# EAGLE design DOORLOCK_v3 (EAGLE 7.5.0)

## Sheet 1 of 2
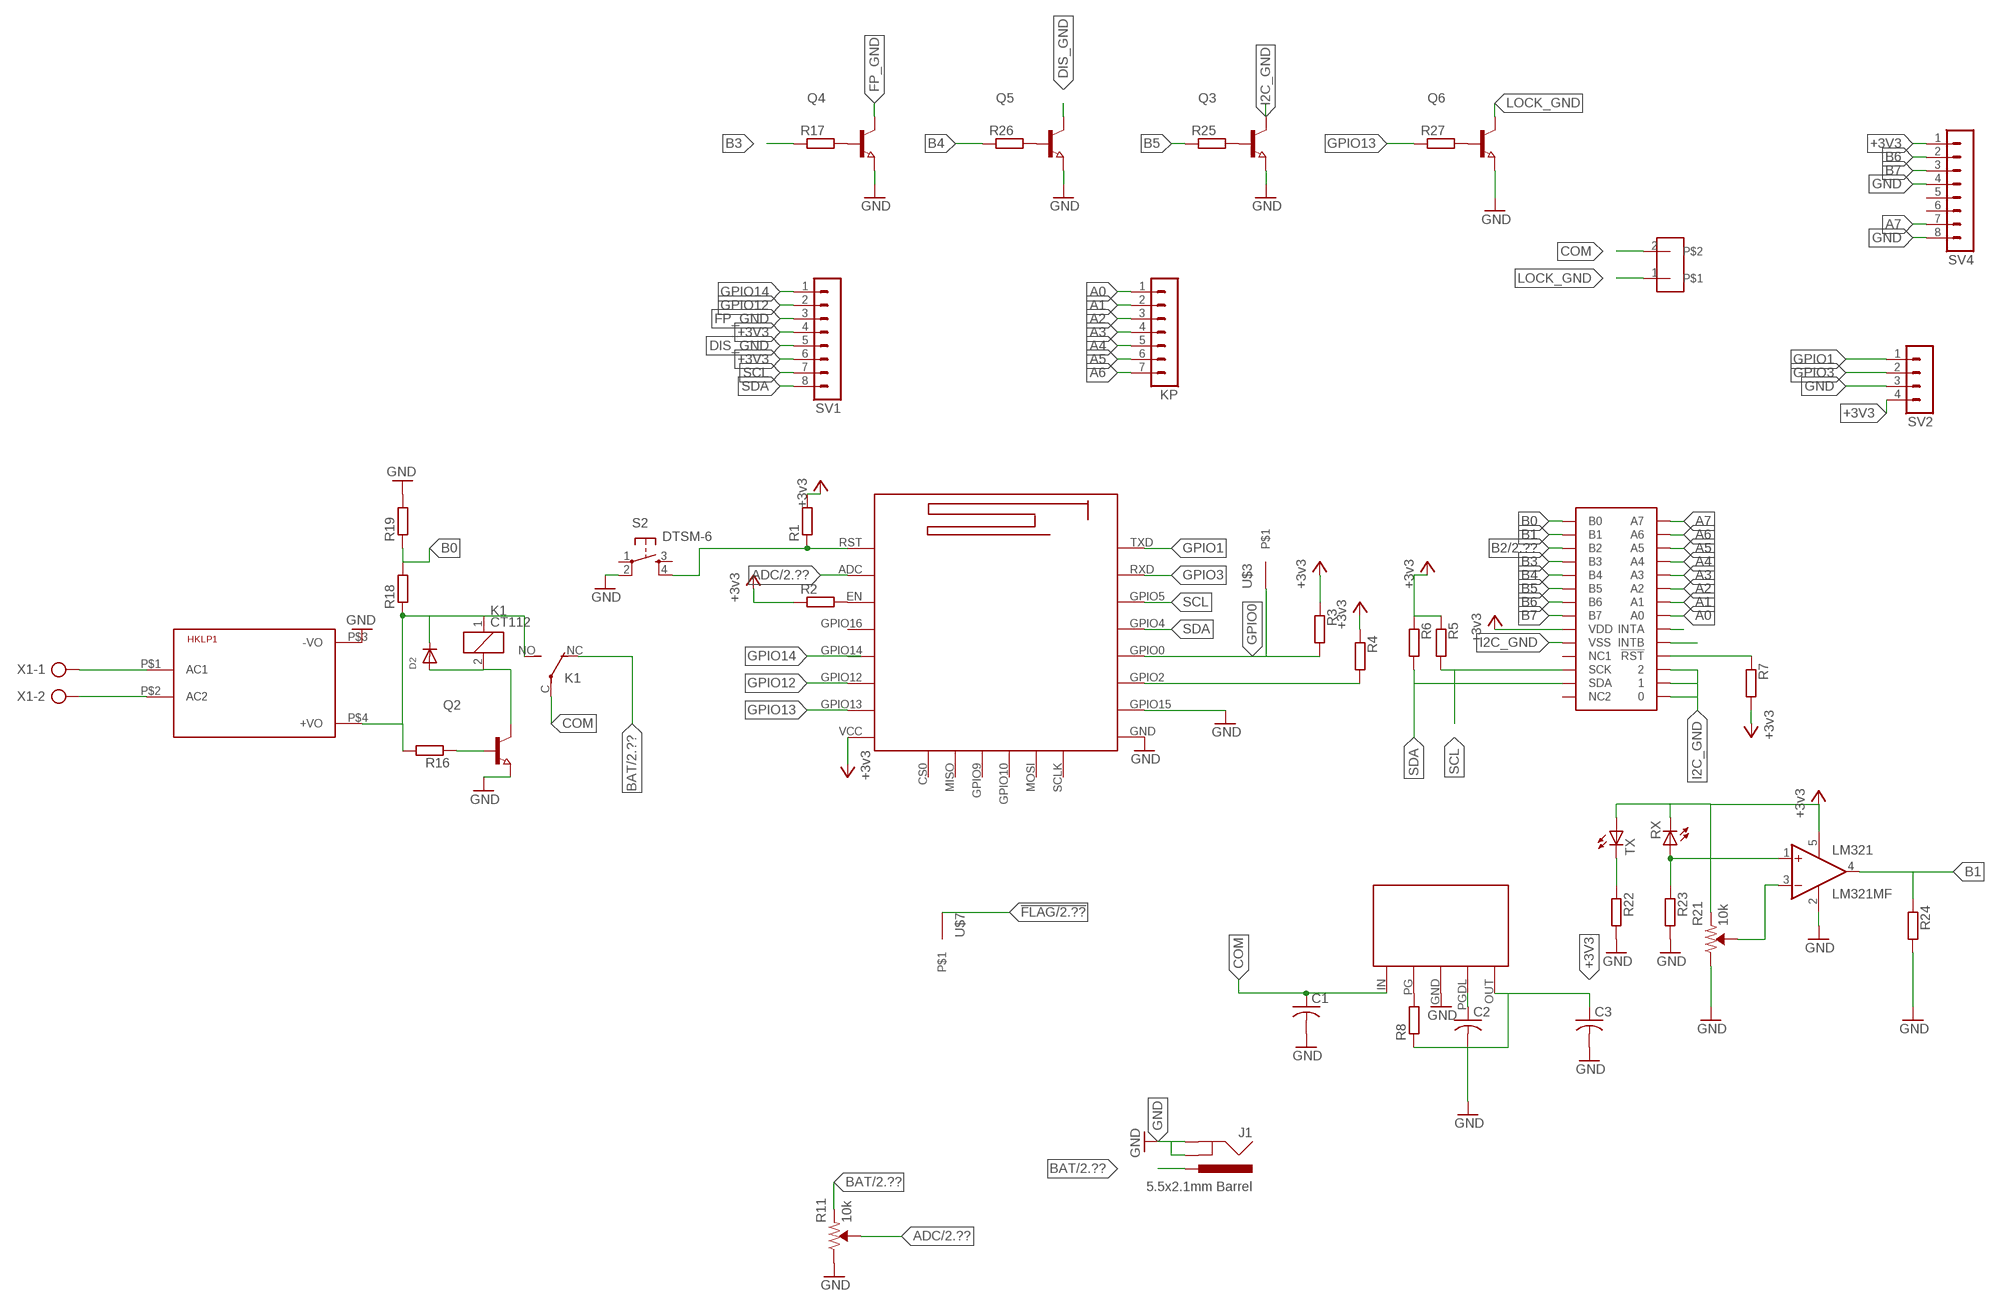
[diagram p0: schematic, sheet 1]

### Parts
C1  C-USC1206  [C1206]
C2  C-USC1206  [C1206]
C3  C-USC1206  [C1206]
D2  DIODESOD-123  [SOD-123]
HKLP1  HKLPM01  [HKLPM01]
J1  5.5x2.1mm Barrel  POWER_JACKSMD  [POWER_JACK_SMD]
K1  CT112  [CT-SLIM]
KP  MA07-1  [MA07-1]
LM321  LM321MF  [SOT23-5]
MCP23017  MCF23017  [MAX23017]
MP2014  MP2014  [MP2014]
Q2  NPN-TRANSISTOR_SOT89  [SOT89]
Q3  NPN-TRANSISTOR_SOT89  [SOT89]
Q4  NPN-TRANSISTOR_SOT89  [SOT89]
Q5  NPN-TRANSISTOR_SOT89  [SOT89]
Q6  NPN-TRANSISTOR_SOT89  [SOT89]
R1  R-EU_0204/2V  [0204V]
R2  R-EU_0204/2V  [0204V]
R3  R-EU_0204/2V  [0204V]
R4  R-EU_0204/2V  [0204V]
R5  R-EU_0204/2V  [0204V]
R6  R-EU_0204/2V  [0204V]
R7  R-EU_0204/2V  [0204V]
R8  R-EU_0204/2V  [0204V]
R11  10k  TRIMPOT-SMD-3MM-OPEN-1/10W-25%  [TRIMPOT-SMD-TC33X]
R16  R-EU_0204/2V  [0204V]
R17  R-EU_0204/2V  [0204V]
R18  R-EU_0204/2V  [0204V]
R19  R-EU_0204/2V  [0204V]
R21  10k  TRIMPOT-SMD-3MM-OPEN-1/10W-25%  [TRIMPOT-SMD-TC33X]
R22  R-EU_0204/2V  [0204V]
R23  R-EU_0204/2V  [0204V]
R24  R-EU_0204/2V  [0204V]
R25  R-EU_0204/2V  [0204V]
R26  R-EU_0204/2V  [0204V]
R27  R-EU_0204/2V  [0204V]
RX  LED5MM  [LED5MM]
S2  DTSM-6  [DTSM-6]
SV1  MA08-1  [MA08-1]
SV2  MA04-1  [MA04-1]
SV4  MA08-1  [MA08-1]
TX  LED5MM  [LED5MM]
U$1  ESP12E  [ESP-12E]
U$3  M1  [M1]
U$4  MALE2PIN  [MALE2PIN]
U$7  M1  [M1]
X1  AK500/2-H  [AK500/2-H]

### Nets
!FLAG [GPIO]: U$7.P$1 ; also sheet 2
+3V3 [GPIO]: C3.1 LM321.5(V+) MCP23017.P$9(VDD) MP2014.OUT R1.2 R2.1 R3.1 R4.1 R5.1 R6.1 R7.2 R8.1 R21.3(CCW) RX.K(C) SV1.4 SV1.6 SV2.4 SV4.1 TX.A U$1.VCC ; supply symbol labelled +3v3
+12V: D2.C HKLP1.P$4(+VO) K1.1 K1.NO(2:S) R16.2 R18.1 ; also sheet 2
A0 [GPIO]: KP.1 MCP23017.P$21(A0)
A1 [GPIO]: KP.2 MCP23017.P$22(A1)
A2 [GPIO]: KP.3 MCP23017.P$23(A2)
A3 [GPIO]: KP.4 MCP23017.P$24(A3)
A4 [GPIO]: KP.5 MCP23017.P$25(A4)
A5 [GPIO]: KP.6 MCP23017.P$26(A5)
A6 [GPIO]: KP.7 MCP23017.P$27(A6)
A7 [GPIO]: MCP23017.P$28(A7) SV4.7
ADC [GPIO]: R11.2(WIPER) U$1.ADC ; also sheet 2
B0 [GPIO]: MCP23017.P$1(B0) R18.2 R19.1
B1 [GPIO]: LM321.4(OUT) MCP23017.P$2(B1) R24.1
B2 [GPIO]: MCP23017.P$3(B2) ; also sheet 2
B3 [GPIO]: MCP23017.P$4(B3) R17.1
B4 [GPIO]: MCP23017.P$5(B4) R26.1
B5 [GPIO]: MCP23017.P$6(B5) R25.1
B6 [GPIO]: MCP23017.P$7(B6) SV4.2
B7 [GPIO]: MCP23017.P$8(B7) SV4.3
BAT [GPIO]: J1.VIN0(PWR) K1.NC(2:O) R11.3(CCW) ; also sheet 2
COM: C1.1 K1.C(2:P) MP2014.IN U$4.2
DIS_GND [GPIO]: Q5.2(C) SV1.5
FP_GND [GPIO]: Q4.2(C) SV1.3
GND [GPIO]: C1.2 C2.2 C3.2 HKLP1.P$3(-VO) J1.GND(GNDBREAK) J1.P$4(GND) LM321.2(V-) MP2014.GND Q2.3(E) Q3.3(E) Q4.3(E) Q5.3(E) Q6.3(E) R11.1(CW) R19.2 R21.1(CW) R22.2 R23.2 R24.2 S2.2 SV2.3 SV4.4 SV4.8 U$1.GND U$1.GPIO15 ; also sheet 2
GPIO0 [GPIO]: R3.2 U$1.GPIO0 U$3.P$1
GPIO1 [GPIO]: SV2.1 U$1.TXD
GPIO3 [GPIO]: SV2.2 U$1.RXD
GPIO12 [GPIO]: SV1.2 U$1.GPIO12
GPIO13 [GPIO]: R27.1 U$1.GPIO13
GPIO14 [GPIO]: SV1.1 U$1.GPIO14
I2C_GND [GPIO]: MCP23017.P$10(VSS) MCP23017.P$15 MCP23017.P$16 MCP23017.P$17 Q3.2(C)
LOCK_GND: Q6.2(C) U$4.1
N$1 [GPIO]: R1.1 S2.4 U$1.RST
N$2: R2.2 U$1.EN
N$3 [AC]: HKLP1.P$1(AC1) X1.1
N$4 [GPIO]: R4.2 U$1.GPIO2
N$5 [GPIO]: LM321.3(-IN) R21.2(WIPER)
N$6: Q3.1(B) R25.2
N$7 [AC]: HKLP1.P$2(AC2) X1.2
N$9: MCP23017.P$18(!RST) R7.1
N$10: MCP23017.P$19(INTB)
N$11: MCP23017.P$20(INTA)
N$12: MP2014.PG R8.2
N$13: C2.1 MP2014.PGDL
N$15: Q2.1(B) R16.1
N$16: Q6.1(B) R27.2
N$26: D2.A K1.2 Q2.2(C)
N$28: Q4.1(B) R17.2
N$30 [GPIO]: R22.1 TX.K(C)
N$31: Q5.1(B) R26.2
N$33 [GPIO]: LM321.1(+IN) R23.1 RX.A
SCL [GPIO]: MCP23017.P$12(SCK) R5.2 SV1.7 U$1.GPIO5
SDA [GPIO]: MCP23017.P$13(SDA) R6.2 SV1.8 U$1.GPIO4
Unconnected: MCP23017.P$11(NC1) MCP23017.P$14(NC2) S2.1 S2.3 SV4.5 SV4.6 U$1.CS0 U$1.GPIO9 U$1.GPIO10 U$1.GPIO16 U$1.MISO U$1.MOSI U$1.SCLK

## Sheet 2 of 2
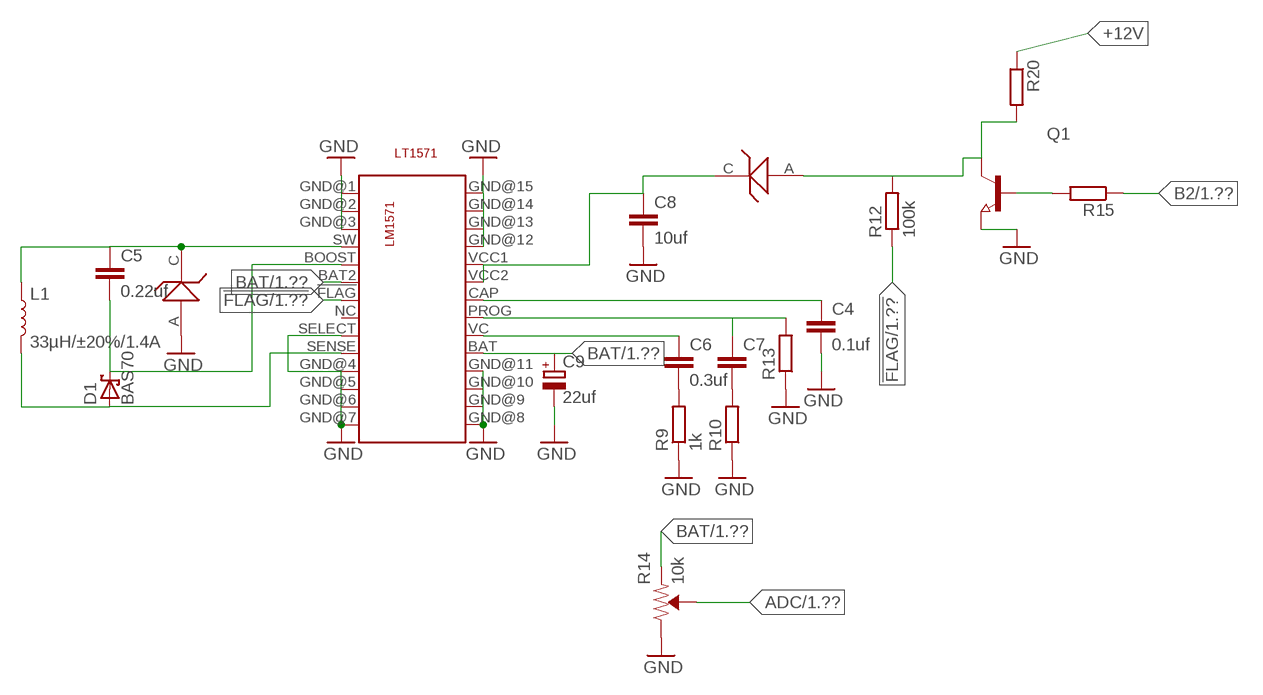
[diagram p1: schematic, sheet 2]

### Parts
C4  0.1uf  C-EUC0805  [C0805]
C5  0.22uf  C-EUC0805  [C0805]
C6  0.3uf  C-EUC0805  [C0805]
C7  C-EUC0805  [C0805]
C8  10uf  C-EUC0805  [C0805]
C9  22uf  CPOL-EUCT3216  [CT3216]
D1  BAS70  [SOT23]
D3  MBRM120T3  [MBRM120T3]
L1  33µH/±20%/1.4A  INDUCTOR-SRN6045-33UH  [SRN6045]
LT1571  LM1571  [LT1571]
Q1  NPN-TRANSISTOR_SOT89  [SOT89]
R9  1k  R-EU_0204/2V  [0204V]
R10  R-EU_0204/2V  [0204V]
R12  100k  R-EU_0204/2V  [0204V]
R13  R-EU_0204/2V  [0204V]
R14  10k  TRIMPOT-SMD-3MM-OPEN-1/10W-25%  [TRIMPOT-SMD-TC33X]
R15  R-EU_0204/2V  [0204V]
R20  R-EU_0204/2V  [0204V]
U$6  MBRM120T3  [MBRM120T3]

### Nets
!FLAG [GPIO]: LT1571.!FLAG R12.1 ; also sheet 1
+12V: R20.1 ; also sheet 1
ADC [GPIO]: R14.2(WIPER) ; also sheet 1
B2 [GPIO]: R15.1 ; also sheet 1
BAT [GPIO]: C9.+ LT1571.BAT LT1571.BAT2 R14.3(CCW) ; also sheet 1
GND [GPIO]: C4.2 C8.2 C9.- LT1571.GND@1 LT1571.GND@2 LT1571.GND@3 LT1571.GND@4 LT1571.GND@5 LT1571.GND@6 LT1571.GND@7 LT1571.GND@8 LT1571.GND@9 LT1571.GND@10 LT1571.GND@11 LT1571.GND@12 LT1571.GND@13 LT1571.GND@14 LT1571.GND@15 LT1571.SELECT Q1.3(E) R9.1 R10.1 R13.1 R14.1(CW) U$6.A ; also sheet 1
N$8 [GPIO]: Q1.1(B) R15.2
N$14: C8.1 D3.C LT1571.VCC1 LT1571.VCC2
N$17 [GPIO]: C4.1 LT1571.CAP
N$18: D3.A Q1.2(C) R12.2 R20.2
N$19: D1.1(A) L1.2 LT1571.SENSE
N$20: C5.1 L1.1 LT1571.SW U$6.C
N$21: C5.2 D1.3(C) LT1571.BOOST
N$22: C6.2 R9.2
N$23: C6.1 LT1571.VC
N$24: C7.2 R10.2
N$25: C7.1 LT1571.PROG R13.2
Unconnected: LT1571.NC

## Library data of the parts
C1-C3 = adafruit:C-US: CAPACITOR, American symbol
C4-C8 = rcl:C-EU: CAPACITOR, European symbol
C9 = rcl:CPOL-EU: POLARIZED CAPACITOR, European symbol
D1 = diode:BAS70: Silicon Schottky Diodes General-purpose diode for high-speed switching
D2 = adafruit:DIODE: Diode SMADIODE - SMA Surface Mount Package 20V 1A Schottky Diode Digikey: 641-1014-6-ND DO-1N4148 - Through Hole Small Current Diode SOD-123 20V 1 A (.5mV Vf) Schottky Diode - Digikey: MBRX120TPMSCT-ND SOD-323 10V 570mA (.38mV Vf, 3ns) Schottky Diode - Digikey: ZLLS410CT-ND SOD-523 30V 30mA Schottky Diode (RB751S-40TE61) - Digikey: RB751S-40TE61CT-ND SOT23-R/W - SOT23 Package (R = Solder Paste/Reflow Ovens, W = Hand-Soldering) BAT54Film 40V 300mA - Digikey: 497-7162-1-ND
D3 U$6 = Alfred:MBRM120T3
HKLP1 = HKLPM01:HKLPM01
J1 = SparkFun-Connectors:POWER_JACK: Power Jack Connector This is the standard 5.5mm barrel jack for power. The PTH is the most common, proven, reliable, footprint. The Slot footprint only works if the mill layer is transmitted to the PCB fab house so be warned. Here are the connectors we sell at SparkFun: DC Barrel Power Jack/Connector <https://www.sparkfun.com/products/119> (PRT-00119) DC Barrel Power Jack/Connector (SMD) <https://www.sparkfun.com/products/12748> (PRT-12748) DC Barrel Jack Adapter - Breadboard Compatible <https://www.sparkfun.com/products/10811> (PRT-10811) It is used on this SparkFun product (and many, many others): SparkFun RedBoard - Programmed with Arduino <https://www.sparkfun.com/products/12757> (DEV-12757) Also, if you need a mating power supply or connector, please check these out: Wall Adapter Power Supply - 9VDC 650mA <https://www.sparkfun.com/products/298> (TOL-00298) DC Barrel Jack Adapter - Male <https://www.sparkfun.com/products/10287> (PRT-10287); PROD_ID: CONN-08106; SF_ID: PRT-12748
K1 = relay:CT112: ULTRA SMALL AUTOMOTIVE RELAY NAiS Slim 1c type en_ds_61205_0000.pdf; OC_FARNELL: unknown; OC_NEWARK: unknown
KP = con-lstb:MA07-1: PIN HEADER; OC_FARNELL: unknown; OC_NEWARK: unknown
L1 = SparkFun-Coils:INDUCTOR: Inductors Resist changes in electrical current. Basically a coil of wire. SparkFun Products: SparkFun Load Cell Amplifier - HX711 <https://www.sparkfun.com/products/13879> IOIO-OTG - V2.2 <https://www.sparkfun.com/products/13613>; PROD_ID: NDUC-11627
LM321 = linear:LM321?*: Low Power Single Op Amp Source: http://cache.national.com/ds/LM/LM321.pdf
LT1571 = Alfred:LM1571
MCP23017 = Alfred:MCF23017
MP2014 = Alfred:MP2014
Q1-Q6 = semicon-smd-ipc:NPN-TRANSISTOR_: NPN TRANSISTOR
R1-R8 R16-R19 R22-R27 = resistor:R-EU_: RESISTOR, European symbol
R9 R10 R12 R13 R15 R20 = rcl:R-EU_: RESISTOR, European symbol
R11 R14 R21 = SparkFun-Resistors:TRIMPOT: Trimming Potentiometer (Trimpot) Three-terminal potentiometers, with an adjustable wiper and two adjustable resistors. A pot can be used to create a configurable voltage divider, or as a variable resistor. "Trimpots" are a subset of potentiometers, usually intended for "set-and-forget" applications. They're often more delicate than standard potentiometers - rated for fewer turns. Variants PTH-KNOB - PTH Trimpot w/ finger-adjustable knob Trimpot 10K with Knob <https://www.sparkfun.com/products/9806> (COM-09806) Datasheet <http://www.sparkfun.com/datasheets/Components/General/TSR-3386.pdf> SMD-3MM-CLOSED-FRAME - SMD 3mm Square Closed-Frame Trimpot Used on e.g. EasyDriver - Stepper Motor Driver <https://www.sparkfun.com/products/12779> Datasheet <http://www.bitechnologies.com/pdfs/22.pdf> (22AR10KTR) SMD-5MM - SMD 5mm Square Closed-Frame Trimpot Used on e.g. IOIO-OTG - V2.2 <https://www.sparkfun.com/products/13613> Datasheet <http://www.vishay.com/docs/51008/ts53.pdf> (TS53YL502MR10) SMD-3MM-1/10W-25% - 3mm Square Open-Frame Trimpot Used on e.g. SparkFun Shapeoko <https://www.sparkfun.com/products/13899> Datasheet <http://www.bourns.com/docs/Product-Datasheets/TC33.pdf> (TC33X-2-103E); PROD_ID: RES-12428, RES-08048
RX TX = adafruit:LED: LED OSRAM: - CHIPLED LG R971, LG N971, LY N971, LG Q971, LY Q971, LO R971, LY R971 LH N974, LH R974 LS Q976, LO Q976, LY Q976 LO Q996 - Hyper CHIPLED LW Q18S LB Q993, LB Q99A, LB R99A - SideLED LS A670, LO A670, LY A670, LG A670, LP A670 LB A673, LV A673, LT A673, LW A673 LH A674 LY A675 LS A676, LA A676, LO A676, LY A676, LW A676 LS A679, LY A679, LG A679 - Hyper Micro SIDELED® LS Y876, LA Y876, LO Y876, LY Y876 LT Y87S - SmartLED LW L88C, LW L88S LB L89C, LB L89S, LG L890 LS L89K, LO L89K, LY L89K LS L896, LA L896, LO L896, LY L896 - TOPLED LS T670, LO T670, LY T670, LG T670, LP T670 LSG T670, LSP T670, LSY T670, LOP T670, LYG T670 LG T671, LOG T671, LSG T671 LB T673, LV T673, LT T673, LW T673 LH T674 LS T676, LA T676, LO T676, LY T676, LB T676, LH T676, LSB T676, LW T676 LB T67C, LV T67C, LT T67C, LS T67K, LO T67K, LY T67K, LW E67C LS E67B, LA E67B, LO E67B, LY E67B, LB E67C, LV E67C, LT E67C LW T67C LS T679, LY T679, LG T679 LS T770, LO T770, LY T770, LG T770, LP T770 LB T773, LV T773, LT T773, LW T773 LH T774 LS E675, LA E675, LY E675, LS T675 LS T776, LA T776, LO T776, LY T776, LB T776 LHGB T686 LT T68C, LB T68C - Hyper Mini TOPLED® LB M676 - Mini TOPLED Santana® LG M470 LS M47K, LO M47K, LY M47K Source: http://www.osram.convergy.de/
S2 = switch-tact:DTSM-6
SV1 SV4 = con-lstb:MA08-1: PIN HEADER; OC_FARNELL: unknown; OC_NEWARK: unknown
SV2 = con-lstb:MA04-1: PIN HEADER; OC_FARNELL: unknown; OC_NEWARK: unknown
U$1 = Alfred:ESP12E
U$3 U$7 = Alfred:M1
U$4 = Alfred:MALE2PIN
X1 = con-ptr500:AK500/2-H: CONNECTOR Aug. 2004 / PTR Meßtechnik: Die Bezeichnung der Serie AK505 wurde geändert. Es handelt sich hierbei um AK500 in horizontaler Ausführung.; OC_FARNELL: unknown; OC_NEWARK: unknown

## Net classes
0 default: width 0.3 mm, drill 0.7 mm, clearance 0.254 mm
1 AC: width 1 mm, drill 0.7 mm, clearance 0.254 mm to class 0, clearance 0.254 mm
2 GPIO: width 0.35 mm, drill 0.7 mm, clearance 0.254 mm to class 0, clearance 0.254 mm to class 1, clearance 0.254 mm
3 zerocross: width 0.35 mm, drill 0.7 mm, clearance 0.254 mm to class 0, clearance 0.254 mm to class 1, clearance 0.254 mm to class 2, clearance 0.254 mm

## Board
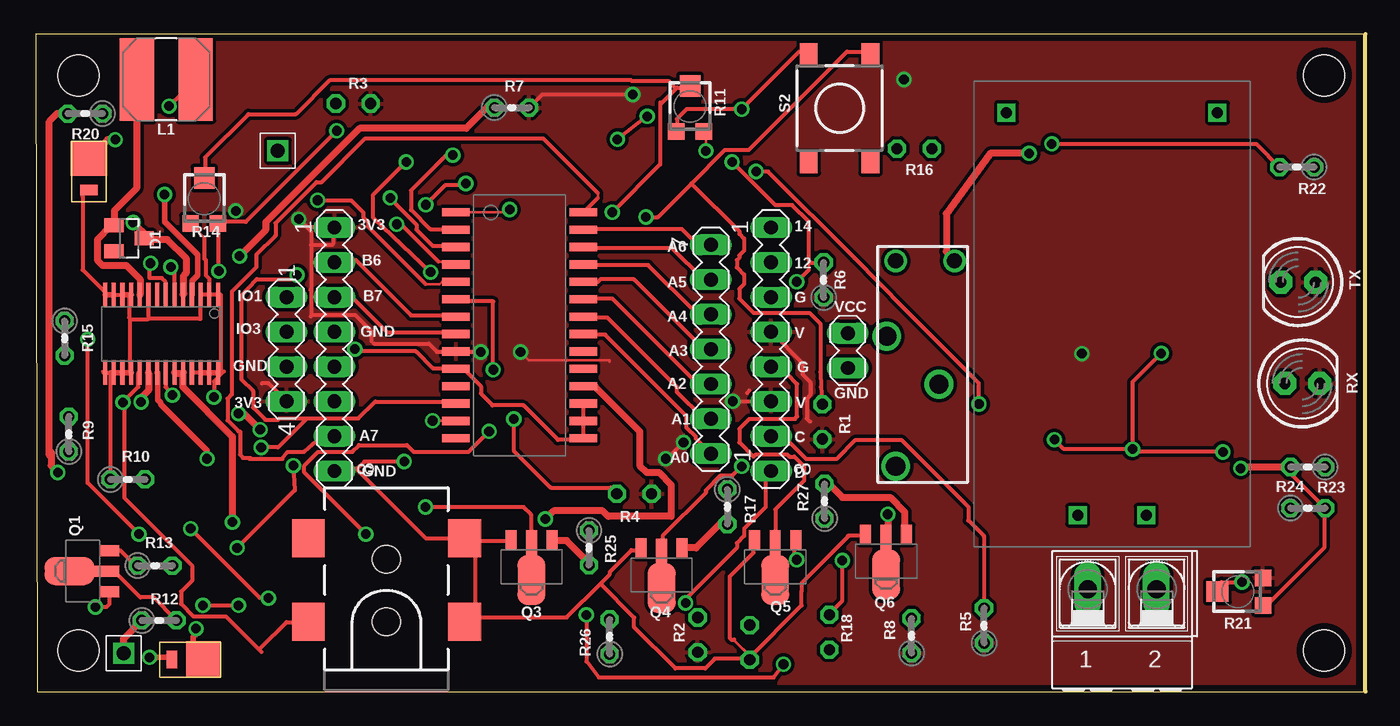
[diagram p2: board, top side]
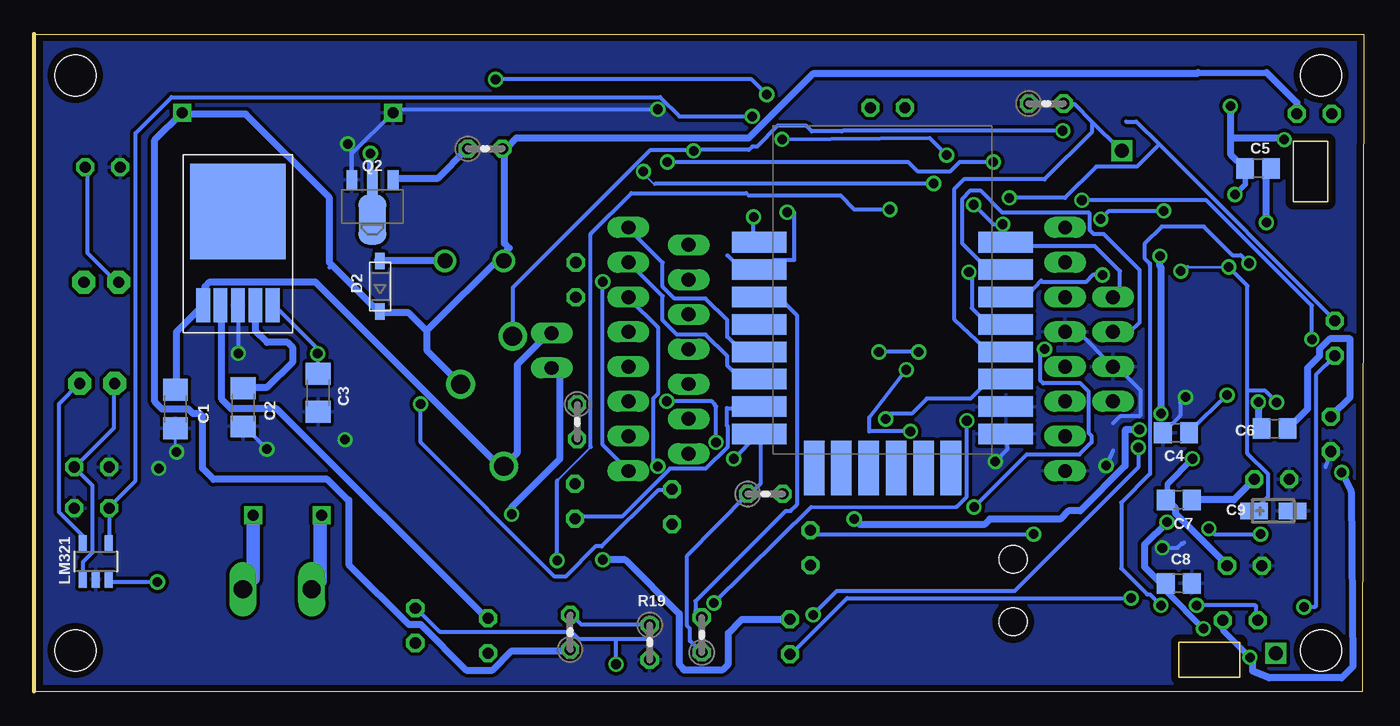
[diagram p3: board, bottom side, seen from below]

Size 97.1 x 48 mm. Coordinates in mm from the lower left corner, seen from the top.
Outline: 0,48 0.1,0 97.1,0 97.1,48 0,48
Copper layers (1*16): Top 0.035mm / dielectric 1.5mm / Bottom 0.035mm
Design rules "default *": minimum track width 0.2mm, minimum drill 0.4mm, track to track 0.1mm, track to pad 0.1mm, pad to pad 0.1mm, via to via 0.1mm, smd to smd 0.1mm, copper to edge 0.5mm, drill to drill 8mil, minimum pad ring 10mil, minimum via ring 8mil, stop-mask expansion 4mil, vias tented up to drill 0mil, thermal gap 10mil
Holes 3 mm at 94.1,45 3.1,45 3.1,3 94.1,3

### Footprints (pad centres in the part's own frame; a part is rotated, then mirrored left to right if it is on the bottom)
C1206 = smd 1.6 x 1.8: 1 -1.4,0; 2 1.4,0
C0805 = smd 1.3 x 1.5: 1 -0.95,0; 2 0.95,0
CT3216 = smd 2 x 1.2: + -1.4,0; - 1.4,0
SOT23 = smd 1 x 1.4: 1 -0.95,-1.1; 2 0.95,-1.1; 3 0,1.1
SOD-123 = smd 1.2 x 0.7: A 1.85,0; C -1.85,0
MBRM120T3 = smd 0.762 x 1.27: A 3.575,1.27 | smd 2.54 x 2.67: C 1.27,1.27
HKLPM01 = drill 0.8 square: P$1 -14.7,2.5; P$2 -14.7,-2.5; P$3 14.7,7.7; P$4 14.7,-7.7
POWER_JACK_SMD = smd 2.8 x 2.4: GND 0,-5.7; P$4 6.1,-5.7; VIN0 0,5.7; VIN1 6.1,5.7 | hole 2.032: 0,0; 4.572,0
CT-SLIM = drill 1.1: 1 -7.45,0; 2 -7.45,4.3 | drill 1.4: C 7.55,0; NC -1.95,-0.65; NO 1.55,3.15
MA07-1 = drill 1.016 long: 1 -7.62,0; 2 -5.08,0; 3 -2.54,0; 4 0,0; 5 2.54,0; 6 5.08,0; 7 7.62,0
SRN6045 = smd 2.5 x 6: 1 -2.175,0; 2 2.125,0
SOT23-5 = smd 0.6 x 1.2: 1 -0.95,-1.306; 2 0,-1.306; 3 0.95,-1.306; 4 0.95,1.306; 5 -0.95,1.306
LT1571 = smd 0.3 x 1.8: !FLAG 3.81,-0.864; BAT 5.715,4.809; BAT2 3.175,-0.864; BOOST 2.54,-0.864; CAP 3.81,4.809; GND@1 0,-0.864; GND@2 0.635,-0.864; GND@3 1.27,-0.864; GND@4 6.35,-0.864; GND@5 6.985,-0.864; GND@6 7.62,-0.864; GND@7 8.255,-0.864; GND@8 8.255,4.809; GND@9 7.62,4.809; GND@10 6.985,4.809; GND@11 6.35,4.809; GND@12 1.905,4.809; GND@13 1.27,4.809; GND@14 0.635,4.809; GND@15 0,4.809; NC 4.445,-0.864; PROG 4.445,4.809; SELECT 5.08,-0.864; SENSE 5.715,-0.864; SW 1.905,-0.864; VC 5.08,4.809; VCC1 2.54,4.809; VCC2 3.175,4.809
MAX23017 = smd 0.6 x 2: P$1 0,0; P$2 1.27,0; P$3 2.54,0; P$4 3.81,0; P$5 5.08,0; P$6 6.35,0; P$7 7.62,0; P$8 8.89,0; P$9 10.16,0; P$10 11.43,0; P$11 12.7,0; P$12 13.97,0; P$13 15.24,0; P$14 16.51,0; P$15 16.51,9.3; P$16 15.24,9.3; P$17 13.97,9.3; P$18 12.7,9.3; P$19 11.43,9.3; P$20 10.16,9.3; P$21 8.89,9.3; P$22 7.62,9.3; P$23 6.35,9.3; P$24 5.08,9.3; P$25 3.81,9.3; P$26 2.54,9.3; P$27 1.27,9.3; P$28 0,9.3
MP2014 = smd 1 x 2.5: GND 0,0; IN -2.54,0; OUT 2.54,0; PG -1.27,0; PGDL 1.27,0 | smd 7 x 7: P$6 0,6.85
SOT89 = smd 0.8 x 1.4: 1 -1.499,-1.981; 3 1.499,-1.981 | smd 0.8 x 1.9: 2 0,-1.727 | smd 2.032 x 3.65: 2@1 0,0.94
0204V = drill 0.813 octagon: 1 -1.27,0; 2 1.27,0
TRIMPOT-SMD-TC33X = smd 1.2 x 1.2: 1 -1,-1.825; 3 1,-1.825 | smd 1.5 x 1.6: 2 0,1.5
LED5MM = drill 0.813 pad 1.676 octagon: A -1.27,0; K 1.27,0
DTSM-6 = smd 1.55 x 1.3: 1 -3.975,2.25; 2 3.975,2.25; 3 -3.975,-2.25; 4 3.975,-2.25
MA08-1 = drill 1.016 long: 1 -8.89,0; 2 -6.35,0; 3 -3.81,0; 4 -1.27,0; 5 1.27,0; 6 3.81,0; 7 6.35,0; 8 8.89,0
MA04-1 = drill 1.016 long: 1 -3.81,0; 2 -1.27,0; 3 1.27,0; 4 3.81,0
ESP-12E = smd 4 x 1.5: ADC -8.62,3.32; EN -8.62,1.32; GND 9.38,-8.68; GPIO0 9.38,-2.68; GPIO2 9.38,-4.68; GPIO4 9.38,-0.68; GPIO5 9.38,1.32; GPIO12 -8.62,-4.68; GPIO13 -8.62,-6.68; GPIO14 -8.62,-2.68; GPIO15 9.38,-6.68; GPIO16 -8.62,-0.68; RST -8.62,5.32; RXD 9.38,3.32; TXD 9.38,5.32; VCC -8.62,-8.68 | smd 1.5 x 4: CS0 -4.62,-11.16; GPIO9 -0.62,-11.16; GPIO10 1.38,-11.16; MISO -2.62,-11.16; MOSI 3.38,-11.16; SCLK 5.38,-11.16
M1 = drill 1.016 square: P$1 0,0
MALE2PIN = drill 1.016 long: 1 0,1.27; 2 0,-1.27
AK500/2-H = drill 1.321 long: 1 -2.515,0; 2 2.515,0

### Placement (x,y rotation side)
C1  86.79,20.64 270 bottom
C2  81.84,20.76 270 bottom
C3  76.36,21.82 270 bottom
C4  13.7,18.9 180 bottom
C5  7.7,38.2 0 bottom
C6  6.5,19.2 0 bottom
C7  13.5,14 0 bottom
C8  13.5,7.9 0 bottom
C9  6.6,13.2 0 bottom
D1  6.8,33.1 270 top
D2  71.84,29.59 90 bottom
D3  13.5,3.6 180 top
HKLP1  78.6,27.58 90 top
J1  25.6,5.1 90 top
K1  62.8,24 270 top
KP  49.3,25 90 top
L1  9.5,44.7 180 top
LM321  92.6,9.5 0 bottom
LT1571  13.3,28.1 180 top
MCP23017  30.68,35 270 top
MP2014  82.22,28.21 0 bottom
Q1  3.4,8.8 90 top
Q2  72.4,35.4 180 bottom
Q3  36.2,9.1 180 top
Q4  45.7,8.5 180 top
Q5  54,9.1 180 top
Q6  62.1,9.5 180 top
R1  57.44,19.71 270 bottom
R2  48.34,4.14 90 bottom
R3  23.18,42.94 0 bottom
R4  43.7,14.44 0 bottom
R5  69.26,4.82 90 top
R6  57.54,30.06 90 top
R7  34.76,42.64 0 top
R8  63.96,4.08 90 top
R9  2.4,18.8 90 top
R10  6.7,15.5 0 top
R11  47.78,42.72 0 top
R12  9,5.2 0 top
R13  8.7,9.2 0 top
R14  12.3,36 0 top
R15  2.1,25.8 270 top
R16  64.17,39.64 0 bottom
R17  50.5,13.5 270 top
R18  57.96,4.33 90 bottom
R19  52.14,3.59 270 bottom
R20  3.6,42.2 180 top
R21  87.8,7.3 90 top
R22  92.1,38.3 180 top
R23  92.9,16.4 180 top
R24  92.9,13.4 0 top
R25  40.4,10.5 270 top
R26  41.9,4 90 top
R27  57.6,13.9 90 top
RX  92.5,22.5 0 top
S2  58.7,42.6 90 top
SV1  53.7,25 270 top
SV2  18.3,25 270 top
SV4  21.8,25 270 top
TX  92.2,29.9 180 top
U$1  35.52,27.49 0 bottom
U$3  17.66,39.49 90 top
U$4  59.3,24.9 180 top
U$6  2.6,40.2 270 top
U$7  6.4,2.8 0 top
X1  79.34,7.47 0 top

### Tracks (layer width: path | path; a pad name or v marks a point on that pad's centre or on a via)
!FLAG  (via drill 0.7)
  Top 0.2: 9.47,29.93 9.47,29 LT1571.!FLAG | 8.3,31.2 v8.38,31.27
  Top 0.305: v12.2,6.3 v14.8,6.3 | 9.47,29.93 9.2,30.2 8.3,30.2 8.3,31.2
  Top 0.5: U$7.P$1 6.4,3.87 R12.1
  Bottom 0.2: 15.6,31.25 15.6,31.15 15.67,31.15 | 7.85,6.25 7.9,6.3 | 11.65,33.95 11.6,33.88
  Bottom 0.3: 11.6,33.88 9.6,31.88 8.97,31.88 v8.38,31.27 | 15.6,15.9 17.7,13.8
  Bottom 0.305: 7.85,6.25 7.85,5.25 R12.1 7.6,5 | 7.9,6.3 v12.2,6.3 | v14.8,6.3 15.6,7.1 15.8,7.1 17.7,9 17.7,13.8 | 15.6,31.15 15.6,15.9 | 11.65,33.95 14.75,33.95 16,32.7 16,31.65 15.6,31.25
+3V3  (via drill 0.7)
  Top 0.2: 53.6,21.5 SV1.6 | SV1.6 53.65,21.18 53.6,21.29 | v46,17 46.1,16.9 46.1,17 | SV1.6 | v63.4,44.7 63.3,44.8 | 22.1,34 21.9,34 | 20.1,29.4 20,29.3 | 20.1,27.4 20.2,27.5 | 24.5,25.6 24.7,25.4 | v35.4,24.8 36,24.2 41.9,24.2 41.9,24.1
  Top 0.3: 53.6,21.5 53.6,21.29 | v50.9,21.2 SV1.6 | SV1.4 53.71,26.27 56.01,23.98 56.01,23.16 56.56,22.61 56.56,21.67 56.49,21.59 56.49,21.57 56.31,21.39 56.31,19.94 56.54,19.71
  Top 0.305: 52.1,22 51.94,21.8 | 46.1,17 v47.3,18.2 | 19.81,33.89 SV4.1 22.1,34 21.7,33.6 21.7,32.7 21.6,32.6 20.1,32.6 | 19.81,33.89 v19.2,34.5 | v14.6,35.1 14.5,35.1 | R7.2 36.99,43.6 v43.6,43.6 | SV2.4 16.99,22.5 16.5,22.5 | 19.81,33.89 20.1,33.6 20.1,32.6 | 20.1,32.6 20.1,29.4 20.1,27.4 | 20.2,27.5 23.3,27.5 24.5,26.3 24.5,25.6 | 24.7,25.4 28.7,25.4 29.3,24.8 v32.5,24.8
  Bottom 0.2: 76.4,23.27 C3.1 | 79.55,28.18 MP2014.OUT | 93.55,11.38 LM321.5 | 44.02,18.55 U$1.VCC 44.33,18.67 | 47.4,20.9 47.4,21 | R2.1 48.37,2.87
  Bottom 0.3: 95.3,13.12 93.55,11.38 | 44.02,15.22 44.55,14.7 R4.1 | v47.3,18.2 47.3,20.8 47.4,20.9 | 47.4,21 47.6,21.2 v50.9,21.2 | 48.37,2.87 49.2,3.7 49.2,4.6
  Bottom 0.305: 76.4,23.27 v76.4,24.68 76.4,25.02 79.55,28.18 | 95.3,13.12 95.3,21 93.8,22.5 RX.K | 44.02,15.22 44.02,18.55 | 44.33,18.67 v46,17 | v19.2,34.5 18.6,35.1 v14.6,35.1 | v43.6,43.6 44.7,44.7 v63.4,44.7 | R4.1 49.4,9.93 49.4,4.8 49.2,4.6 | v32.5,24.8 v35.4,24.8
  pour Top: 97.1,48 97.1,0 0.1,0 0.1,48
+12V
  Bottom 0.305: 75.52,31.32 75.35,31.15 75.52,30.98 | 62.79,31.46 62.79,31.99
  Bottom 0.43: 12.1,45.2 7.07,45.2
  Bottom 0.5: 12.1,45.2 12.17,45.15 40.18,45.15 44.9,40.42 61.88,40.42 62.58,39.73 R16.2 62.75,39.55 62.75,32.73 62.4,32.38 62.79,31.99 68.44,26.34 | 68.44,26.34 69.75,27.65 71.67,27.65 D2.C 72.02,27.82 75.35,31.15 | 75.52,31.32 75.52,36.05 81.65,42.17 86.2,42.17 HKLP1.P$4 88.3,40.28 88.3,21.18 87.77,20.65 85.85,20.65 85.5,20.3 85,20.3 84.8,20.1 84.8,16.3 84,15.5 75.7,15.5 74.2,14 74.12,14 74.12,9.28 69.75,4.9 68.88,4.9 65.55,1.57 63.62,1.57 62.23,2.98 58.02,2.98 R18.1 | 68.44,26.34 68.44,24.94 K1.NO | K1.1 62.79,31.46 | 7.07,45.2 4.87,43 R20.1
A0
  Top 0.2: 40,26.07 MCP23017.P$21 | 49.27,17.5 KP.1 | 48.2,18.6 48.2,18.48
  Top 0.3: 41.58,26.07 40,26.07 | 47.5,20.15 47.5,19.3 48.2,18.6 | 48.2,18.48 KP.1
  Top 0.305: 47.5,20.15 41.58,26.07
A1
  Top 0.2: 40,27.3 MCP23017.P$22
  Top 0.3: 41.75,27.3 46.83,22.23 46.83,21.88 48.75,19.95 49.27,19.95 KP.2
  Top 0.305: 41.75,27.3 40,27.3
A2
  Top 0.2: 40,28.7 MCP23017.P$23 | 49.27,22.57 KP.3
  Top 0.3: 42.1,28.7 48.23,22.57 49.27,22.57
  Top 0.305: 42.1,28.7 40,28.7
A3
  Top 0.2: 40,29.93 MCP23017.P$24 | 49.27,25.02 KP.4
  Top 0.3: 41.05,29.93 40,29.93 | 41.23,30.1 43.68,30.1 48.75,25.02 49.27,25.02
  Top 0.305: 41.23,30.1 41.05,29.93
A4
  Top 0.2: 40,31.15 MCP23017.P$25 | 49.27,27.65 KP.5
  Top 0.3: 40,31.15 44.73,31.15 48.23,27.65 49.27,27.65
A5
  Top 0.2: 40,32.38 MCP23017.P$26 | 49.27,30.1 KP.6
  Top 0.3: 46.48,32.38 48.75,30.1 49.27,30.1
  Top 0.305: 46.48,32.38 40,32.38
A6
  Top 0.2: 40,33.77 MCP23017.P$27 | 49.27,32.73 KP.7
  Top 0.3: 47.18,33.77 48.23,32.73 49.27,32.73
  Top 0.305: 47.18,33.77 40,33.77
A7
  Top 0.2: 41.05,36.4 41.05,36.05 | 40,35 MCP23017.P$28 | 15.67,17.07 15.6,17
  Top 0.3: 41.05,36.05 40,35 | 41.05,36.4 37.05,40.4 24.05,40.4 | SV4.7 21.8,18.55 20.75,18.55 19.58,17.5 18.38,17.5 18,17 | 20.85,37.2 20.5,37.2 17.5,34.2 17.5,33.3 16.1,31.9 16.1,31 14.3,29.2 14.3,21.7 14,21.4 | 14.9,17.3 15.12,17.07 | 14.8,19 14.9,19
  Top 0.305: 15.6,17 18,17 | 20.85,37.2 24.05,40.4 | 14.9,19 14.9,17.3 | 15.12,17.07 15.67,17.07 | 14,21.4 14,19.8 14.8,19
ADC  (via drill 0.7)
  Top 0.2: 12.35,37.5 R14.2 | 46.76,44.04 46.83,44.1 | 47.7,44.1 R11.2 | 43.5,44.62 43.52,44.6 | 45.6,43 45.66,42.94
  Top 0.3: 46.83,44.1 47.7,44.1 | 45.66,42.94 46.76,44.04 | v42.1,35 45.6,38.5 45.6,43
  Top 0.305: 12.35,37.5 12.35,39 15.53,42.17 19,42.17 21.45,44.62 43.5,44.62 | 43.52,44.6 46.2,44.6 46.76,44.04
  Bottom 0.2: 45.43,30.8 44.02,30.8 U$1.ADC 43.6,31 43.1,31.5
  Bottom 0.305: 45.43,30.8 46.48,31.85 | 43.1,31.5 41.6,31.5 41.6,35 v42.1,35
B0  (via drill 0.7)
  Top 0.2: 57.85,5.6 R18.2 | MCP23017.P$1 34.4,35 v34.6,35.2
  Top 0.305: v58.9,9.57 58.9,6.65 57.85,5.6
  Bottom 0.2: 58.9,15.4 56.45,17.85 | 52.25,4.9 R19.1 | 57.85,5.6 R18.2
  Bottom 0.3: 56.45,17.85 56.45,33.42 | 57.85,5.6 57.15,4.9
  Bottom 0.305: 56.45,33.42 53.48,36.4 45.08,36.4 44.9,36.23 38.23,36.23 37.2,35.2 v34.6,35.2 | v58.9,9.57 58.9,15.4 | 57.15,4.9 52.25,4.9
B1  (via drill 0.7)
  Top 0.2: 30.55,33.77 MCP23017.P$2
  Top 0.305: 30.55,33.77 28.8,33.77 27.4,35.17 27.4,36.6 29.98,39.17 v30.45,39.17 | v44.65,42 v42.48,40.33
  Bottom 0.2: 91.62,10.85 LM321.4 | 91.62,13.3 R24.1 91.62,13.47
  Bottom 0.3: 91.62,13.3 91.62,10.85
  Bottom 0.305: v42.48,40.33 31.7,40.42 v30.45,39.17 | v44.65,42 49.98,42 51.38,43.4 87.07,43.4 89.7,40.77 89.7,15.4 91.62,13.47
B2  (via drill 0.7)
  Top 0.2: 30.55,32.55 MCP23017.P$3 | v25.88,36.05 25.88,36.02
  Top 0.305: 30.55,32.55 28.98,32.55 27.8,33.73 27.8,34.1 25.88,36.02
  Bottom 0.2: 2.1,27.12 R15.1
  Bottom 0.305: 14.92,39.95 16.6,41.62 17.35,41.62 | 14.92,39.95 2.1,27.12 | v25.88,36.05 21.8,36.05 19.53,38.33 16.55,38.33 14.92,39.95
B3  (via drill 0.7)
  Top 0.2: MCP23017.P$4 30.55,31.32 30.48,31.4 29.4,31.4
  Top 0.305: v52.6,37.98 53.48,37.98 59.77,31.68 63.4,28 68.88,22.52 v68.88,21 | v28.48,35.55 29.93,37 31.3,37 v31.4,37.1 | 29.4,31.4 26.68,34.12 v26.35,34.12
  Bottom 0.2: 52.43,37.8 v52.6,37.98 52.6,37.8 51.8,37 51.7,37.1 | 50.5,14.7 R17.1
  Bottom 0.3: 50.5,14.7 51.55,14.7
  Bottom 0.305: v26.35,34.12 27.05,34.12 v28.48,35.55 | v68.88,21 68.88,18.2 59.08,8.4 58.3,8.4 56.1,10.6 55.65,10.6 51.55,14.7 | v31.4,37.1 51.7,37.1
B4  (via drill 0.7)
  Top 0.2: MCP23017.P$5 30.55,29.93 29.68,29.93 29.5,29.75 28.45,29.75
  Top 0.3: v3.77,25.73 3.77,15.25 v7.52,11.5
  Top 0.305: 28.45,29.75 24.25,33.95 24.25,34.3 23.9,34.65 23.9,35 23.03,35.88 v20.58,35.88 | v16.98,6.83 16.38,6.83 v11.3,11.9
  Bottom 0.2: 41.75,2.8 R26.1
  Bottom 0.305: v20.58,35.88 11.47,35.88 3.77,28.18 v3.77,25.73 | v16.98,6.83 37.73,6.83 41.75,2.8 | v11.3,11.9 10.9,11.5 v7.52,11.5
B5  (via drill 0.7)
  Top 0.2: 31.1,28.5 MCP23017.P$6
  Top 0.3: 23.6,18 23.1,17.5 20.6,17.5 19.6,16.5 19.6,16
  Top 0.305: 31.1,28.5 33.4,28.5 v33.4,23.5 | v33.1,19 31.6,17.5 27.6,17.5 27.1,18 23.6,18 | v24.1,11.5 19.6,16
  Bottom 0.2: 40.1,11.5 R25.1
  Bottom 0.305: v33.4,23.5 36.1,20 36.1,19 v33.1,19 | 40.1,11.5 v24.1,11.5
B6
  Top 0.2: 30.55,27.48 MCP23017.P$7 | 21.8,31.5 SV4.2
  Top 0.305: 30.55,27.48 27.4,27.48 23.38,31.5 21.8,31.5
B7
  Top 0.2: 30.55,26.25 MCP23017.P$8 | 21.8,28.7 SV4.3
  Top 0.305: 30.55,26.25 25.65,26.25 23.2,28.7 21.8,28.7
BAT  (via drill 0.7)
  Top 0.2: 13.35,34.12 R14.3 13.4,34.3 | 10.1,29 LT1571.BAT2 | 16.2,3.15 16.38,3.15 | 19.88,5.08 J1.VIN0 | v48.94,39.48 48.93,39.9 48.93,40.77 R11.3
  Top 0.3: 6.47,21.12 v6.35,21.12
  Top 0.305: v13.35,30.7 13.35,34.12 | v6.35,21.12 7.47,22.25 7.47,23.25 LT1571.BAT | 10.1,29 10.1,30.75 v9.85,31 | 6.47,21.12 6.47,14.12 11.4,9.2 11.4,8.1 10.6,7.3 10.6,6.4 11.5,5.5 13.85,5.5 16.2,3.15 16.48,2.88 | 19.88,5.08 18.3,5.08 16.38,3.15 | 13.4,34.3 15.32,34.3 v21.98,40.95
  Bottom 0.2: 7.97,13.25 C9.+ | 12.85,31 v9.85,31 | 38.1,40.9 38.2,40.9 | 48.87,39.55 v48.94,39.48 49.01,39.55
  Bottom 0.3: 6.97,15.88 8.47,17.38 8.47,22 7.22,22 | 40.3,40.9 40.7,41.3 | 38.05,40.95 38.1,40.9
  Bottom 0.305: 6.97,15.88 6.97,14.25 7.97,13.25 | 7.22,22 v6.35,21.12 | 8.47,22 8.47,29.62 v9.85,31 | K1.NC 62.15,29.48 52.08,39.55 49.01,39.55 | v13.35,30.7 12.85,31 | v21.98,40.95 38.05,40.95 | 48.87,39.55 44.9,39.55 44.65,39.8 44.3,39.8 42.8,41.33 40.7,41.3 | 38.1,40.9 40.3,40.9
COM
  Bottom 0.5: C1.1 86.72,22.05 86.72,26.25 84.8,28.18 MP2014.IN 84.62,28.35 84.62,29.57 84.27,29.93 76.57,29.93 63.1,16.45 K1.C 61.8,17.45 61.8,23.9 59.53,26.17 U$4.2
DIS_GND
  Top 0.3: 54,13.3 Q5.2 | 56.1,15.4 56.1,16.45 55.4,17.15 55.05,17.15 54.88,17.32 52.6,17.32 52.43,17.15 51.38,18.2 51.38,19.18 52.1,19.9 52.1,19.91 55.47,19.91 55.47,19.96 55.6,20.09 55.6,22.45 54.89,23.16 54.84,23.16 54.27,23.73 SV1.5
  Top 0.305: 56.1,15.4 54,13.3
FP_GND  (via drill 0.7)
  Top 0.2: 45.77,10.32 Q4.2
  Top 0.3: 48.93,14.7 49.98,15.75 50.85,15.75 v51.55,16.45
  Top 0.305: 45.77,10.32 45.77,11.38 48.93,14.53 48.93,14.7
  Bottom 0.3: 51.55,26.6 51.55,21.75 51.9,21.4 51.9,16.8 v51.55,16.45
  Bottom 0.305: 51.55,26.6 53.65,28.7 SV1.3
GND  (via drill 0.7)
  Top 0.2: LT1571.GND@8 4.85,23.38 4.92,23.3 | 7.35,9.12 R13.1 | 12.72,29.12 LT1571.GND@2 | 13.47,29 LT1571.GND@1 | 5.47,15.5 R10.1 | 13.72,23.38 13.47,23.38 LT1571.GND@15 13.47,23.47 | R14.1 12.3,33.17 | LT1571.GND@4 6.8,28.81 | 6.8,27.3 6.9,27.2 | 8.2,27.2 8.22,27.22 | 7,23.3 6.9,23.4 | U$6.A 3.4,36.16 | LT1571.GND@3 12,28.93 | 12,27.2 11.98,27.22 | 41.93,8.57 41.93,8.75 | 44.2,10.32 Q4.3 | 55.75,46.73 56.45,46.73 S2.2 | 46.83,40.95 R11.1 | 52.2,2.5 52.25,2.45 R19.2 52.08,2.45 | 52.43,11.03 Q5.3 | 23.38,16.27 23.43,16.23 | 21.8,16.27 SV4.8 | 52.2,2.5 50.68,4.03 50.68,3.92 | 52.2,2.5 52.2,2.4 | 51,3.8 52.3,2.5 | 12.3,31.6 12.4,31.5 | 31.6,11.03 32.12,11.03 J1.P$4 31.43,11.2 31.6,11.03 | 31.6,5.42 32.12,5.42 J1.GND 31.43,5.25 31.6,5.42
  Top 0.3: LT1571.GND@1 LT1571.GND@2 LT1571.GND@3 | 6.8,28.81 6.8,27.3 | 8.2,27.2 6.9,27.2 6.9,23.4 | LT1571.SELECT 8.22,27.22 11.98,27.22 | 5.04,29.16 LT1571.GND@7 | 12,28.93 12,27.2 | 46.83,40.95 46.83,41.83 47.52,42.52 v51.55,42.52 55.75,46.73 | 52.43,11.03 52.43,10.15 50.68,8.4 50.68,4.03 | R23.2 91.63,15.94 | 50.68,3.92 50.8,3.8 51,3.8 | 52.2,2.4 49.6,2.4 48.9,1.7 | 43.7,4.7 43.7,5.4 | 13.47,29 13.47,23.47 | v18.8,16.5 18.9,14.7 | 94.1,13 R24.2
  Top 0.305: LT1571.GND@8 5.47,23.29 5.47,15.5 | LT1571.GND@6 LT1571.GND@5 | LT1571.GND@13 LT1571.GND@12 | 12.3,33.17 12.3,31.6 | 4.92,23.3 7,23.3 | 3.4,36.16 3.4,30.8 5.04,29.16 | 7.35,9.12 6.18,10.3 Q1.3 | Q3.3 34.58,11.03 32.12,11.03 32.12,5.42 38.77,5.42 41.23,7.88 | 44.2,10.32 43.5,10.32 41.93,8.75 | 41.23,7.88 41.93,8.57 | 52.08,2.45 55.93,6.3 55.93,7.35 55.93,7.92 59.3,11.3 59.3,11.38 60.48,11.38 Q6.3 | J1.P$4 28.45,11.2 23.43,16.23 24,16.8 v26.9,16.8 | 21.8,16.27 23.38,16.27 | 91.63,15.94 R24.2 | v80.1,17.7 75.1,17.7 v74.4,18.4 | v86.7,17.5 80.3,17.5 v80.1,17.7 | v82.2,24.7 80.1,22.6 v80.1,17.7 | v74.2,40 89.13,40 R22.2 | 48.9,1.7 46.7,1.7 43.7,4.7 | 43.7,5.4 41.23,7.88 | 18.9,14.7 v14.7,10.5 | 94.1,13 94.1,10.5 90.1,6.5 R21.1 | 12.4,31.5 12.4,30.4 12.66,30.14 LT1571.GND@2 | 13.72,23.38 13,22.65 v13,21.5
  Top 0.4: 5.47,23.29 LT1571.GND@9 LT1571.GND@10 LT1571.GND@11 | LT1571.GND@7 LT1571.GND@6 | LT1571.GND@5 LT1571.GND@4 | LT1571.GND@15 LT1571.GND@14 LT1571.GND@13
  Top 0.5: R23.2 88.1,16.4 v88,16.3
  Bottom 0.2: 70.8,42.35 HKLP1.P$3 | U$1.GPIO15 26,20.65 26,20.52 | U$1.GND 27.6,18.5 27.6,18.52 | 26.18,18.73 U$1.GND | 26.18,18.55 U$1.GND | C2.2 81.76,19.36 | v74.4,18.4 74.4,18.6 | 86.9,17.3 86.79,17.41 C1.2 86.79,17.59 v86.7,17.5 | MP2014.GND 82.2,28.19 | R24.2 94.1,13.5 94.22,13.5 | 26.1,19 U$1.GND | 20.84,26.27 SV4.4 | 16.3,20.2 16.4,20.1
  Bottom 0.3: 70.8,42.35 70.62,42.52 | 73.9,39.28 Q2.3 | 13.3,10.8 13.2,10.8 | SV2.3 18.03,23.73 | v13,21.5 13.4,21.1
  Bottom 0.305: 70.62,42.52 v51.55,42.52 | 26.17,18.82 26.1,19 26.12,18.77 | 81.76,19.36 v80.1,17.7 | 82.2,28.19 v82.2,24.7 | HKLP1.P$3 73.9,39.28 | Q2.3 73.9,39.7 v74.2,40 | U$1.GND 26.02,17.68 v26.9,16.8 | C4.2 13.4,20.15 13.4,21.1 | 18.3,17.6 v18.8,16.5 | v14.7,10.5 13.6,10.5 13.3,10.8 | 13.2,10.8 13.1,10.9 | SV2.3 20.84,26.27 | 18.03,23.73 16.3,22 16.3,20.2 | 16.4,20.1 17.8,20.1 18.3,19.6 | R9.1 2.79,16.41
  Bottom 0.5: v88,16.3 87.7,16.3
  pour Bottom: 97.1,48 97.1,0 0.1,0 0.1,48
GPIO0
  Bottom 0.2: 17.78,39.55 U$3.P$1 | 27.23,24.68 26.18,24.68 U$1.GPIO0
  Bottom 0.305: 17.78,39.55 19.81,41.59 | 19.81,41.59 21.1,42.88 21.8,42.88 R3.2 | 27.23,24.68 29.88,27.15 29.88,36.72 29.2,37.4 23.3,37.4 19.81,40.89 19.81,41.59
GPIO1
  Bottom 0.2: 26,32.55 U$1.TXD
  Bottom 0.305: 26,32.55 19.65,32.55 17.8,30.7 17.8,29.31 SV2.1
GPIO3
  Bottom 0.2: 27.4,30.8 26.18,30.8 U$1.RXD
  Bottom 0.305: 27.4,30.8 29.3,32.7 29.3,36 28.7,36.6 28,36.6 26.4,35 20.1,35 20,34.9 20,33.7 19.7,33.4 18.98,33.4 16.38,30.8 16.38,26.95 17.05,26.27 SV2.2
GPIO12
  Bottom 0.2: 45.43,22.75 44.02,22.75 U$1.GPIO12
  Bottom 0.3: 53.65,31.32 51.2,28.88 51.2,27.12 50.15,26.07 48.05,26.07 46.48,24.5 46.48,23.8 45.43,22.75
  Bottom 0.305: 53.65,31.32 SV1.2
GPIO13
  Bottom 0.2: 45.25,20.65 44.02,20.65 U$1.GPIO13 | 57.5,12.78 R27.1
  Bottom 0.3: 57.5,12.78 54.18,12.78 50.68,16.27 48.05,16.27 46.48,17.85 46.48,19.43 46.5,19.43 46.5,20.7 45.25,20.7 45.25,20.65
GPIO14
  Bottom 0.2: 45.25,24.68 44.02,24.68 U$1.GPIO14
  Bottom 0.3: 51.2,31.32 51.2,29.57 50.33,28.7 48.05,28.7 46.48,27.12
  Bottom 0.305: 51.2,31.32 53.65,33.77 SV1.1 | 46.48,27.12 46.48,25.9 45.25,24.68
I2C_GND  (via drill 0.7)
  Top 0.2: 40,18.38 MCP23017.P$15 40,18.55 | 30.55,23.62 MCP23017.P$10 31.23,23.57 | 40,19.6 MCP23017.P$16 40,19.77 | 40,21 MCP23017.P$17
  Top 0.3: 27.75,24.85 28.98,23.62 | 40,18.55 40,19.6 | 40,19.77 40,21 | 40,18.38 38.12,18.38 35.6,20.9 33.35,20.9 32.5,21.75 32.5,22.3 31.23,23.57
  Top 0.305: Q3.2 36.15,10.85 36.15,12.95 35.62,13.47 v28.45,13.47 | 28.98,23.62 30.55,23.62 | 27.75,24.85 23.46,24.85 v23.3,25.01
  Bottom 0.3: 20.68,22.5 20.1,21.93 | 20.1,18.9 19.88,18.68
  Bottom 0.305: v28.45,13.47 24.6,17.32 20.75,17.32 19.88,18.2 19.88,18.68 | 20.68,22.5 23.4,22.5 23.6,22.7 23.6,24.7 v23.3,25.01 | 20.1,21.93 20.1,18.9
LOCK_GND  (via drill 0.7)
  Top 0.5: v62.23,12.95 62.23,11.38 Q6.2
  Bottom 0.5: v62.23,12.95 62.23,13.47 58.73,16.98 58.73,23.05 U$4.1
N$1  (via drill 0.7)
  Top 0.2: 60.83,46.73 S2.4
  Top 0.3: 47.88,37.1 45.43,34.65 v44.55,34.65 | 47.88,37.1 50.33,39.55 | 47.88,37.1 51.38,33.6 51.38,33.42 51.73,33.08 51.73,32.2 51.38,31.85 51.38,31.68 51.2,31.5 51.2,30.98 51.73,30.45 51.73,29.75 51.38,29.4 51.38,28.7 52.43,27.65 56.5,27.65 57.3,26.85 57.3,23.35 57.33,22.23 R1.1
  Top 0.305: 60.83,46.73 59.25,46.73 52.08,39.55 50.33,39.55
  Bottom 0.2: 44.55,33.25 44.02,32.73 U$1.RST
  Bottom 0.305: 44.55,33.25 v44.55,34.65
N$2
  Bottom 0.305: 42.45,28.52 41.4,27.48 41.4,13.65 41.85,13.2 42.2,13.2 48.8,6.6 48.8,5.87 R2.2
  Bottom 0.5: 42.45,28.52 43.85,28.52 U$1.EN
N$3
  Bottom 1: HKLP1.P$1 76.22,12.78 76.22,8.05 76.75,7.53 X1.1
N$4  (via drill 0.7)
  Top 0.305: v34.9,19.9 34.9,17.6 37.6,14.9 41.97,14.9 R4.2
  Bottom 0.2: U$1.GPIO2 27.43,22.67
  Bottom 0.305: 27.43,22.67 28.7,21.4 31.9,21.4 33,20.3 34.5,20.3 v34.9,19.9
N$5  (via drill 0.7)
  Top 0.3: v88.1,8 86.6,8 86.6,7.5 R21.2
  Bottom 0.3: 91.6,8 LM321.3
  Bottom 0.305: v88.1,8 91.6,8
N$6
  Top 0.305: 37.73,11.03 Q3.1
  Top 0.5: 37.73,11.03 38.77,11.03 40.52,9.28 R25.2
N$7
  Bottom 1: HKLP1.P$2 81.12,12.78 81.12,8.22 81.82,7.53 X1.2
N$8  (via drill 0.7)
  Top 0.3: 5.38,6.41 5.15,6.17
  Top 0.305: 5.38,6.41 Q1.1 | 5.15,6.17 v4.35,6.17
  Bottom 0.2: 2.1,24.5 R15.2
  Bottom 0.3: 3.48,6.25 3.55,6.17
  Bottom 0.305: 3.48,6.25 3.48,23.12 2.1,24.5 | 3.55,6.17 v4.35,6.17
N$9  (via drill 0.7)
  Top 0.5: MCP23017.P$18 40,22.23 40.88,22.23 44.1,19 44.1,16.5 44.6,16 45.5,16 46.4,15.1 46.4,12.8 41.8,12.8 41.4,13.2 37.8,13.2 v37.2,12.6 | R7.1 33.35,42.7 33,42.7 31.43,41.12 23.62,41.12 16.8,34.3 16.8,33.73 v14.88,31.8 | v14.8,20.3 15.2,20.3 v16.38,19.12
  Bottom 0.5: v14.8,20.3 14.8,30.98 14.88,31.05 v14.88,31.8 | v16.38,19.12 17.38,19.12 17.43,19.07 17.43,16.48 20.7,13.2 21.55,13.2 22.15,12.6 27.3,12.6 27.7,12.2 36.8,12.2 v37.2,12.6
N$12
  Bottom 0.5: MP2014.PG 83.4,28.18 83.4,21.35 82.7,20.65 79.38,20.65 64.08,5.35 R8.2
N$13
  Bottom 0.5: MP2014.PGDL 80.95,26.35 80.1,25.5 78.6,25.5 78.2,25.1 78.2,24.1 80.07,22.23 81.82,22.23 C2.1
N$14  (via drill 0.7)
  Top 0.4: D3.C 12.3,2.4 11.5,3.2 11.5,4 11.7,4.2 v11.7,4.6
  Top 0.5: v14.35,12.38 14.35,18.62 10.72,22.25 10.72,23.25 | 10.72,23.25 LT1571.VCC1 | LT1571.VCC2 10.22,23.25 10.72,23.25
  Bottom 0.4: v11.7,4.6 14.45,7.35 C8.1
  Bottom 0.5: 14.35,8 C8.1 14.8,7.9 16,9.1 16,10.72 v14.35,12.38
N$15
  Bottom 0.5: Q2.1 70.8,37.45 67.65,37.45 65.55,39.55 R16.1
N$16
  Top 0.5: Q6.1 63.45,11.55 63.45,13.12 62.4,14.18 58.9,14.18 58.02,15.05 57.68,15.05 R27.2
N$17  (via drill 0.7)
  Top 0.2: 9.47,23.25 LT1571.CAP
  Top 0.3: v9.97,21.65 9.47,22.25 9.47,23.25
  Bottom 0.2: 12.72,19 C4.1
  Bottom 0.305: v9.97,21.65 12.72,19
N$18  (via drill 0.7)
  Top 0.305: R12.2 10.22,5.25 8.6,6.88 7.62,6.88 5.7,8.8
  Top 0.4: D3.A 9.75,2.5 v8.3,2.5
  Top 0.5: 0.97,17.25 0.97,17.5 | 0.97,17.5 0.97,41.65 1.53,42.2 R20.2 | 5.7,8.8 Q1.2 | v1.6,16 1.1,16.5 1.1,17.5 0.97,17.5
  Bottom 0.4: v8.3,2.5 10.27,4.47 R12.2
  Bottom 0.5: 8.1,1.5 8.1,2.5 v8.3,2.5
  Bottom 0.508: v1.6,16 0.9,14.6 0.8,1.8 1.6,1 6.9,1 8.1,1.5
N$19
  Top 0.5: L1.2 7.35,44.62 7.35,36.75 5.72,35.12 5.72,34.12 D1.1 5.47,34 4.47,33 4.47,31.5 4.85,31.12 6.6,31.12 7.6,30.12 7.6,29 LT1571.SENSE
N$20  (via drill 0.7)
  Top 0.305: L1.1 v9.72,42.75
  Top 0.4: U$6.C 4.7,39.76 | LT1571.SW 11.4,30 11.8,30.4 11.8,31.9 9.4,34.3 v9.4,36.3
  Top 0.5: 4.7,39.76 5.24,40.3 v5.8,40.3
  Bottom 0.4: C5.1 8.65,37.05 v9.4,36.3
  Bottom 0.5: v9.72,42.75 9.72,40.4 | 9.72,40.4 9.72,39.25 8.72,38.25 C5.1 | v5.8,40.3 5.9,40.4 9.72,40.4
N$21  (via drill 0.7)
  Top 0.305: 10.72,29 LT1571.BOOST
  Top 0.5: v7.1,34.25 8.22,33.12 D1.3 7.97,33 9.6,33 11,31.6 11,30.6 10.8,30.4 10.8,29.07 10.72,29
  Bottom 0.5: v7.1,34.25 7.1,37.88 6.85,38.12 C5.2
N$22
  Bottom 0.5: C6.2 5.47,19.25 4.1,20.62 4.1,23.62 3.23,24.5 3.23,25 2.48,25.75 0.97,25.75 0.97,21.5 2.35,20.12 R9.2
N$23  (via drill 0.7)
  Top 0.5: LT1571.VC 8.22,23.25 8.22,22 7.67,21.45 v7.67,21.15
  Bottom 0.5: 7.47,19.25 C6.1 7.67,19.43 v7.67,21.15
N$24
  Bottom 0.5: C7.2 9.47,14 R10.2
N$25  (via drill 0.7)
  Top 0.4: v12.5,17 12.5,17.6 9.1,21 9.1,21.1 8.9,21.3 8.9,23.25 LT1571.PROG
  Bottom 0.4: 14.35,14 14.35,15.15 v12.5,17
  Bottom 0.5: C7.1 14.35,14 13.72,13.38 13.72,13 9.97,9.25 R13.2
N$26  (via drill 0.7)
  Top 0.5: v72.55,39.3 69.7,39.3 66.5,34.9 66.5,32.15 K1.2
  Bottom 0.5: v72.55,39.3 72.55,37.27 Q2.2 | 72.02,31.5 D2.A K1.2
N$28
  Top 0.305: 47.35,10.5 Q4.1
  Top 0.5: 47.35,10.5 48.23,10.5 49.98,12.25 50.5,12.25 R17.2
N$30
  Bottom 0.2: 91.1,29.93 TX.K
  Bottom 0.305: 91.1,29.93 93.2,32.02 93.2,38.15 R22.1
N$31  (via drill 0.7)
  Top 0.3: 55.4,9.8 55.4,11.03
  Top 0.5: v55.58,9.62 55.4,9.8 | 55.4,11.03 Q5.1
  Bottom 0.5: v55.58,9.62 53.93,9.62 50,5.7 50,2 49.7,1.7 49.7,1.6 46.8,1.6 46.4,2 46.4,4.28 45.43,5.25 41.93,5.25 R26.2
N$33
  Bottom 0.2: 94.07,16.27 R23.1 94.07,16.45 | 91.27,22.4 91.23,22.45
  Bottom 0.3: LM321.1 93.55,9.45 92.85,10.15 | 94.07,16.27 92.85,15.05 | 94.07,16.45 91.27,19.25 | 91.23,22.45 RX.A
  Bottom 0.305: 92.85,15.05 92.85,10.15 | 91.27,19.25 91.27,22.4
SCL  (via drill 0.7)
  Top 0.2: 30.55,21.18 MCP23017.P$12 | 54.7,18.55 53.83,18.55 SV1.7 | 69.22,6.12 R5.2 | 17.66,19.84 17.78,19.95
  Top 0.3: 17.78,19.95 19.8,19.95 17.68,17.82 v16.45,17.82 | 15,22.8 15,28.9 16.12,30.12 | 15.85,21.95 15.85,20.75 16.76,19.84 17.66,19.84
  Top 0.305: 30.55,21.18 24.78,21.18 23.55,19.95 19.8,19.95 | 69.22,6.12 69.22,11.38 68.1,12.5 68.1,13.5 63.23,18.38 59.88,18.38 58.5,17 56.25,17 54.7,18.55 | 15,22.8 15.85,21.95 | v40.2,5.6 40.2,2.2 41.1,1.05 53.9,1.05 v54.6,2 | 16.12,30.12 18.78,30.12 v19.08,30.43
  Bottom 0.2: 24.78,28.7 26,28.7 U$1.GPIO5 | 69.22,6.12 R5.2
  Bottom 0.3: 57.85,4.38 57.33,3.85 | 69.22,6.12 67.47,4.38 | v16.45,17.82 16.45,16.38
  Bottom 0.305: 24.78,28.7 23.55,30.02 23.43,29.9 20.3,29.9 19.78,30.43 v19.08,30.43 | 16.45,16.38 25.48,7.35 38.45,7.35 v40.2,5.6 | 57.33,3.85 54.6,3.85 | 54.6,3.85 52.25,3.85 | 67.47,4.38 57.85,4.38 | v54.6,2 54.6,3.85
SDA  (via drill 0.7)
  Top 0.2: v28.98,19.77 30.55,19.77 MCP23017.P$13 | 53.65,16.1 SV1.8 | 57.5,30.45 R6.2 | 56.62,31.33 56.45,31.5 56.45,30.8
  Top 0.3: v47.45,6.47 47.35,6.65 51.2,10.5 51.2,10.85 51.73,11.38 51.73,11.9 53.3,13.47 53.3,15.75 53.65,16.1 | v50.85,38.67 54,35.52 55.23,35.52 56.45,34.3 56.45,31.5 | 56.62,31.33 R6.2 | v55.58,29.93 56.45,30.8
  Top 0.305: v28.83,30.62 24.6,34.65 24.6,36.23 v27.05,38.67
  Bottom 0.2: 53.83,16.27 SV1.8 | 27.4,26.77 26.18,26.77 U$1.GPIO4
  Bottom 0.3: v55.58,29.93 55.58,18.02 53.83,16.27
  Bottom 0.305: v47.45,6.47 40.35,13.47 29.7,13.5 28.98,14.23 v28.98,19.77 | 27.4,26.77 28.62,28 28.62,30.43 v28.83,30.62 | v27.05,38.67 29.5,38.67 30.18,38 32.6,38 33.27,38.67 v50.85,38.67

### Text on the board
tPlace: IO1 | IO3 | GND
tNames: 3V3 | 14 | A6 | B6 | 12 | A5 | B7 | G | VCC | A4 | GND | V | A3 | G | A2 | 3V3 | V | GND | A1 | A7 | C | A0 | GND | D